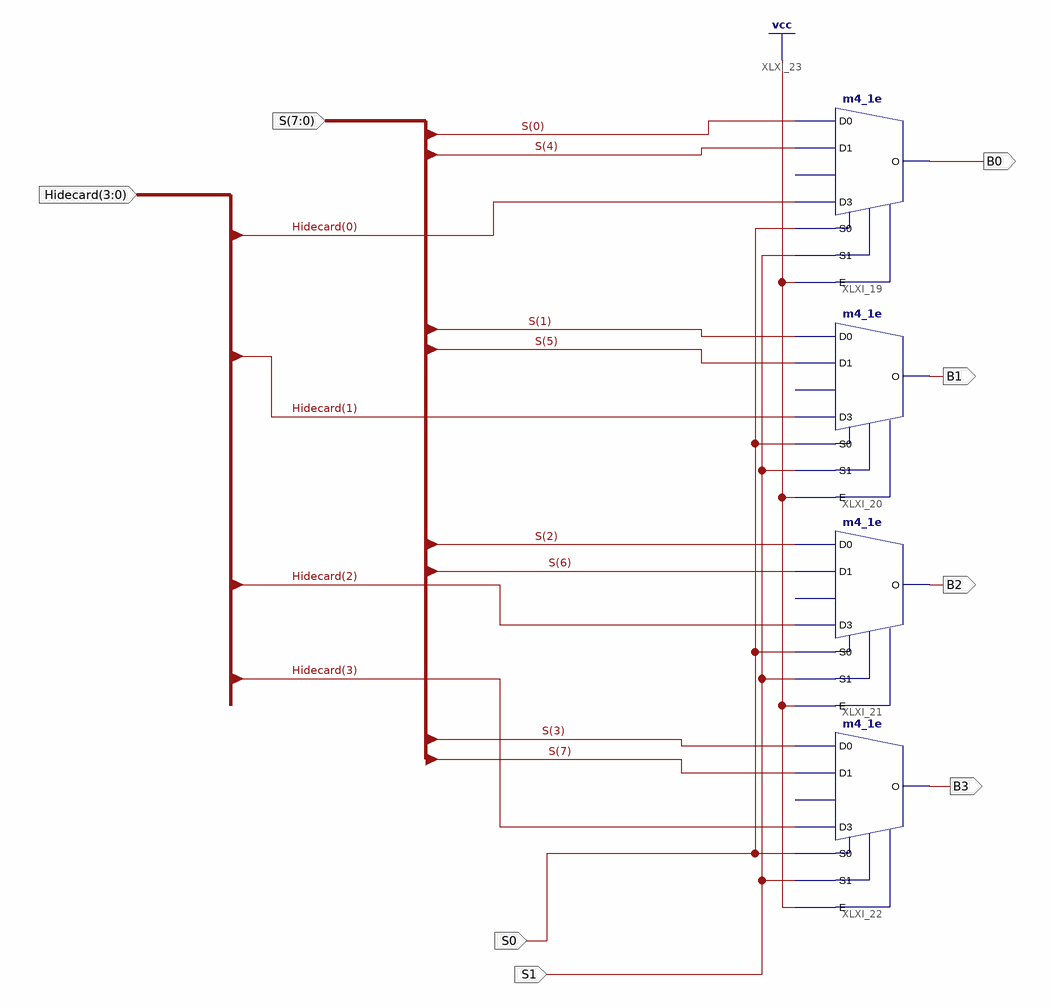
[diagram p0: schematic sheet 1]
// Xilinx ISE schematic MUXFIXED2.sch (spartan6) as structural Verilog: 4 symbols, 8 ports
module MUXFIXED2 (
  input  [7:0] S,
  input  S0,
  input  S1,
  input  [3:0] Hidecard,
  output B0,
  output B1,
  output B2,
  output B3
);

  m4_1e XLXI_19 (.D0(S[0]), .D1(S[4]), .D3(Hidecard[0]), .E(1'b1), .S0(S0), .S1(S1), .O(B0));  // open: D2
  m4_1e XLXI_20 (.D0(S[1]), .D1(S[5]), .D3(Hidecard[1]), .E(1'b1), .S0(S0), .S1(S1), .O(B1));  // open: D2
  m4_1e XLXI_21 (.D0(S[2]), .D1(S[6]), .D3(Hidecard[2]), .E(1'b1), .S0(S0), .S1(S1), .O(B2));  // open: D2
  m4_1e XLXI_22 (.D0(S[3]), .D1(S[7]), .D3(Hidecard[3]), .E(1'b1), .S0(S0), .S1(S1), .O(B3));  // open: D2
endmodule
